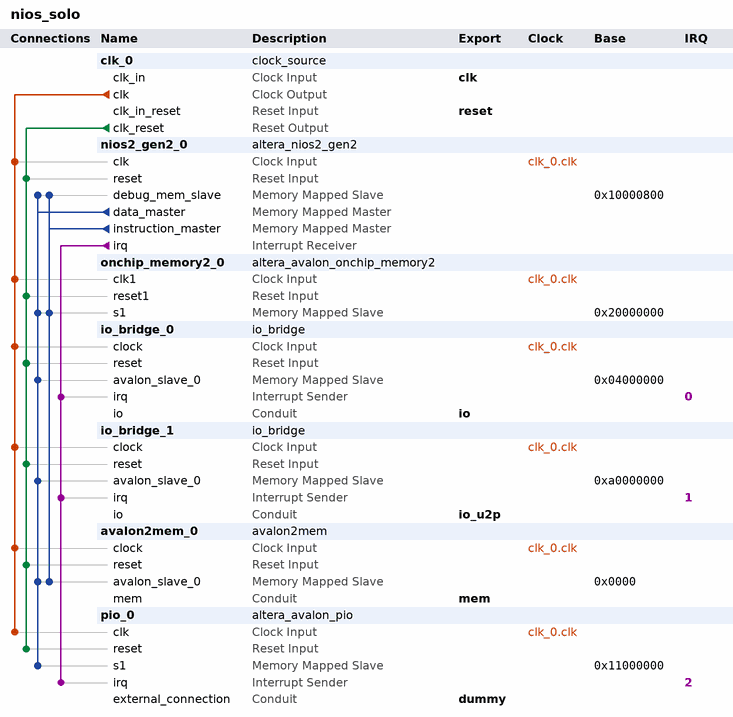
[diagram p0: system contents]
# Platform Designer (Qsys) system nios_solo, Cyclone IV E EP4CE22F17C8
# Parameters at their usual value, and those the tool derives, are not listed.
package require -exact qsys 18.1
create_system nios_solo
set_project_property DEVICE_FAMILY {Cyclone IV E}
set_project_property DEVICE EP4CE22F17C8

add_instance clk_0 clock_source 18.1
set_instance_parameter_value clk_0 clockFrequency 62500000
set_instance_parameter_value clk_0 resetSynchronousEdges DEASSERT

add_instance nios2_gen2_0 altera_nios2_gen2 18.1
set_instance_parameter_value nios2_gen2_0 dcache_size 0
set_instance_parameter_value nios2_gen2_0 exceptionOffset 0
set_instance_parameter_value nios2_gen2_0 exceptionSlave Absolute
set_instance_parameter_value nios2_gen2_0 icache_size 4096
set_instance_parameter_value nios2_gen2_0 impl Fast
set_instance_parameter_value nios2_gen2_0 resetSlave onchip_memory2_0.s1
set_instance_parameter_value nios2_gen2_0 setting_branchpredictiontype Static
set_instance_parameter_value nios2_gen2_0 setting_support31bitdcachebypass false

add_instance onchip_memory2_0 altera_avalon_onchip_memory2 18.1
set_instance_parameter_value onchip_memory2_0 dataWidth 32
set_instance_parameter_value onchip_memory2_0 dualPort false
set_instance_parameter_value onchip_memory2_0 initMemContent true
set_instance_parameter_value onchip_memory2_0 initializationFileName onchip_mem.hex
set_instance_parameter_value onchip_memory2_0 memorySize 2048
set_instance_parameter_value onchip_memory2_0 useNonDefaultInitFile true

add_instance io_bridge_0 io_bridge 1.0

add_instance io_bridge_1 io_bridge 1.0

add_instance avalon2mem_0 avalon2mem 1.0
set_instance_parameter_value avalon2mem_0 g_tag 91

add_instance pio_0 altera_avalon_pio 18.1
set_instance_parameter_value pio_0 direction Input
set_instance_parameter_value pio_0 generateIRQ true
set_instance_parameter_value pio_0 width 1

# connections
add_connection clk_0.clk avalon2mem_0.clock clock
add_connection clk_0.clk io_bridge_0.clock clock
add_connection clk_0.clk io_bridge_1.clock clock
add_connection clk_0.clk nios2_gen2_0.clk clock
add_connection clk_0.clk onchip_memory2_0.clk1 clock
add_connection clk_0.clk pio_0.clk clock
add_connection clk_0.clk_reset avalon2mem_0.reset reset
add_connection clk_0.clk_reset io_bridge_0.reset reset
add_connection clk_0.clk_reset io_bridge_1.reset reset
add_connection clk_0.clk_reset nios2_gen2_0.reset reset
add_connection clk_0.clk_reset onchip_memory2_0.reset1 reset
add_connection clk_0.clk_reset pio_0.reset reset
add_connection nios2_gen2_0.data_master avalon2mem_0.avalon_slave_0 avalon
set_connection_parameter_value nios2_gen2_0.data_master/avalon2mem_0.avalon_slave_0 baseAddress 0x0000
add_connection nios2_gen2_0.data_master io_bridge_0.avalon_slave_0 avalon
set_connection_parameter_value nios2_gen2_0.data_master/io_bridge_0.avalon_slave_0 baseAddress 0x04000000
add_connection nios2_gen2_0.data_master io_bridge_1.avalon_slave_0 avalon
set_connection_parameter_value nios2_gen2_0.data_master/io_bridge_1.avalon_slave_0 baseAddress 0xa0000000
add_connection nios2_gen2_0.data_master nios2_gen2_0.debug_mem_slave avalon
set_connection_parameter_value nios2_gen2_0.data_master/nios2_gen2_0.debug_mem_slave baseAddress 0x10000800
add_connection nios2_gen2_0.data_master onchip_memory2_0.s1 avalon
set_connection_parameter_value nios2_gen2_0.data_master/onchip_memory2_0.s1 baseAddress 0x20000000
add_connection nios2_gen2_0.data_master pio_0.s1 avalon
set_connection_parameter_value nios2_gen2_0.data_master/pio_0.s1 baseAddress 0x11000000
add_connection nios2_gen2_0.instruction_master avalon2mem_0.avalon_slave_0 avalon
set_connection_parameter_value nios2_gen2_0.instruction_master/avalon2mem_0.avalon_slave_0 baseAddress 0x0000
add_connection nios2_gen2_0.instruction_master nios2_gen2_0.debug_mem_slave avalon
set_connection_parameter_value nios2_gen2_0.instruction_master/nios2_gen2_0.debug_mem_slave baseAddress 0x10000800
add_connection nios2_gen2_0.instruction_master onchip_memory2_0.s1 avalon
set_connection_parameter_value nios2_gen2_0.instruction_master/onchip_memory2_0.s1 baseAddress 0x20000000
add_connection nios2_gen2_0.irq io_bridge_0.irq interrupt
set_connection_parameter_value nios2_gen2_0.irq/io_bridge_0.irq irqNumber 0
add_connection nios2_gen2_0.irq io_bridge_1.irq interrupt
set_connection_parameter_value nios2_gen2_0.irq/io_bridge_1.irq irqNumber 1
add_connection nios2_gen2_0.irq pio_0.irq interrupt
set_connection_parameter_value nios2_gen2_0.irq/pio_0.irq irqNumber 2

# exported interfaces
add_interface clk clock sink
set_interface_property clk EXPORT_OF clk_0.clk_in
add_interface dummy conduit end
set_interface_property dummy EXPORT_OF pio_0.external_connection
add_interface io conduit end
set_interface_property io EXPORT_OF io_bridge_0.io
add_interface io_u2p conduit end
set_interface_property io_u2p EXPORT_OF io_bridge_1.io
add_interface mem conduit end
set_interface_property mem EXPORT_OF avalon2mem_0.mem
add_interface reset reset sink
set_interface_property reset EXPORT_OF clk_0.clk_in_reset

set_interconnect_requirement {$system} qsys_mm.clockCrossingAdapter HANDSHAKE
set_interconnect_requirement {$system} qsys_mm.enableEccProtection FALSE
set_interconnect_requirement {$system} qsys_mm.insertDefaultSlave FALSE
set_interconnect_requirement {$system} qsys_mm.maxAdditionalLatency 1

save_system nios_solo.qsys
